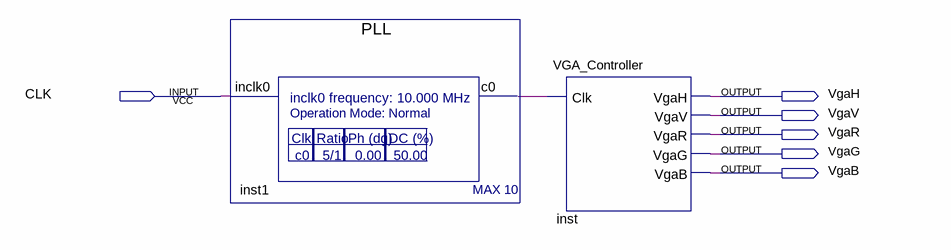
[diagram p0: schematic sheet]
// Quartus schematic 03-VGA_Controller.bdf as structural Verilog: 2 symbols, 6 pins
module \03-VGA_Controller  (
  input  CLK,
  output VgaH,
  output VgaV,
  output VgaR,
  output VgaG,
  output VgaB
);

  wire inst1_c0;

  PLL inst1 (.inclk0(CLK), .c0(inst1_c0));
  VGA_Controller inst (.Clk(inst1_c0), .VgaH(VgaH), .VgaV(VgaV), .VgaR(VgaR), .VgaG(VgaG), .VgaB(VgaB));
endmodule
